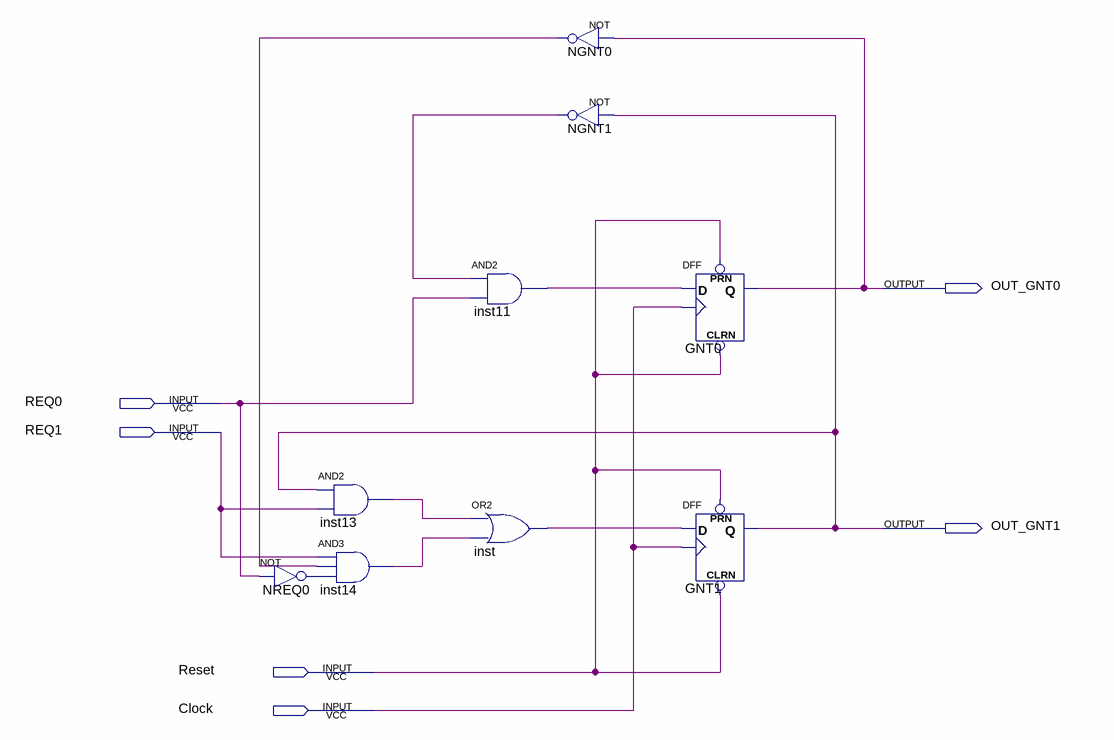
[diagram p0: schematic sheet]
// Quartus schematic lab04.bdf as structural Verilog: 9 symbols, 6 pins
module lab04 (
  input  REQ0,
  input  REQ1,
  input  Reset,
  input  Clock,
  output OUT_GNT0,
  output OUT_GNT1
);

  wire inst11_out, inst13_out, inst14_out, inst_out, NGNT0_out, NGNT1_out, NREQ0_out;

  not NREQ0 (NREQ0_out, REQ0);
  and inst13 (inst13_out, OUT_GNT1, REQ1);
  and inst14 (inst14_out, REQ1, NGNT0_out, NREQ0_out);
  and inst11 (inst11_out, NGNT1_out, REQ0);
  or inst (inst_out, inst13_out, inst14_out);
  not NGNT0 (NGNT0_out, OUT_GNT0);
  not NGNT1 (NGNT1_out, OUT_GNT1);
  DFF GNT0 (.CLRN(Reset), .CLK(Clock), .D(inst11_out), .PRN(Reset), .Q(OUT_GNT0));
  DFF GNT1 (.CLRN(Reset), .CLK(Clock), .D(inst_out), .PRN(Reset), .Q(OUT_GNT1));
endmodule
